# Altium project Hierarchical Example.PrjPcb
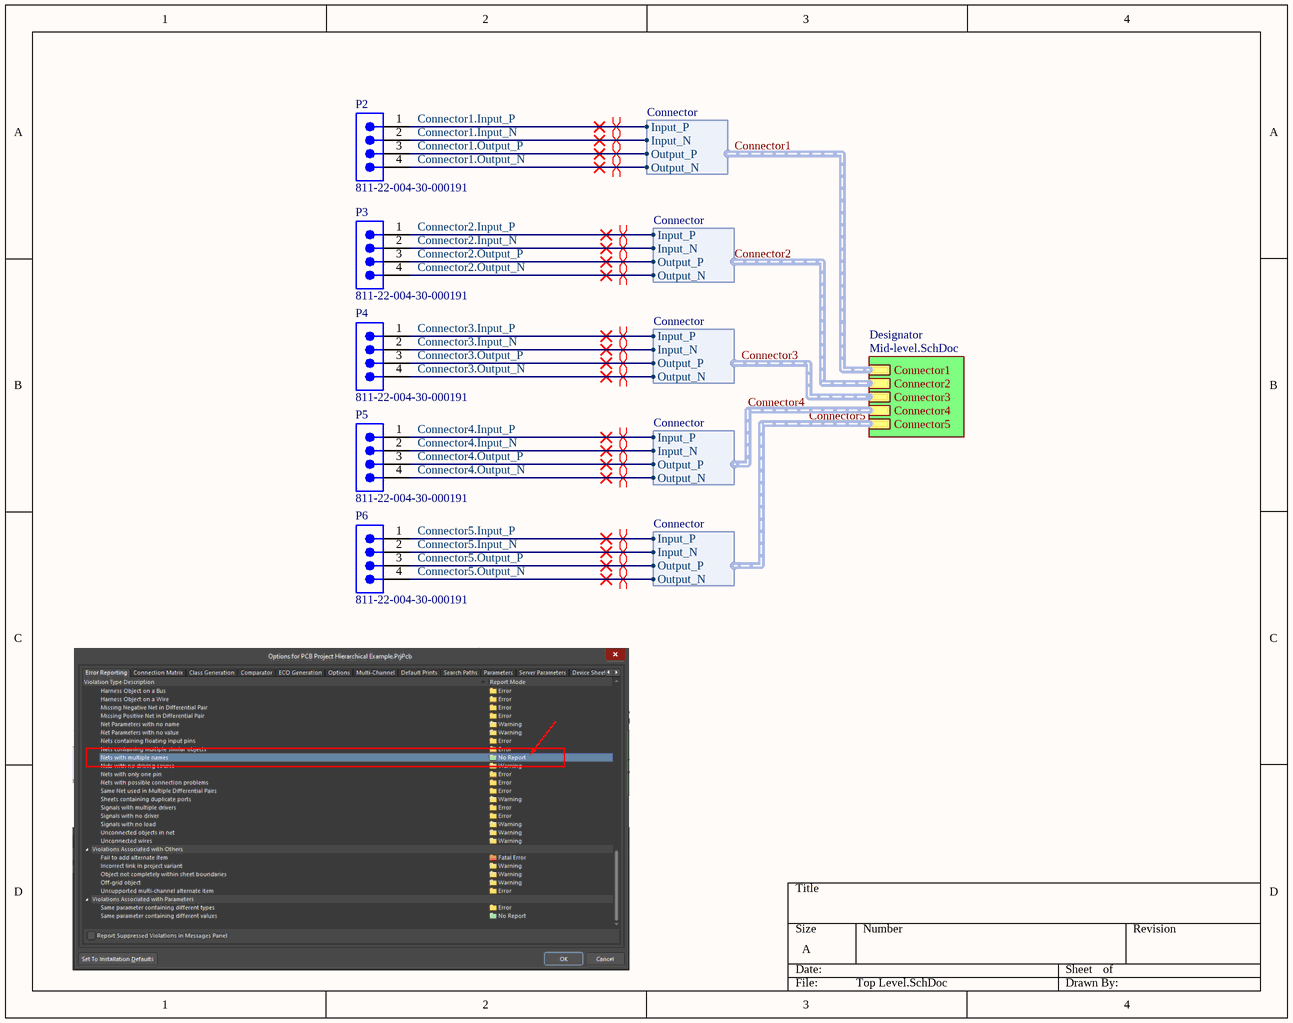
[diagram p0: Top Level.SchDoc]
3 sheets, 10 parts. Net scope: hierarchical (ports join the sheet entries above them; power ports are global).
Board file: Hierarchical Example PCB.PcbDoc
Sheets:
  Top Level.SchDoc
    Designator = Mid-level.SchDoc
      Connector1 = Connector.SchDoc
      Connector2 = Connector.SchDoc
      Connector3 = Connector.SchDoc
      Connector4 = Connector.SchDoc
      Connector5 = Connector.SchDoc

## Sheet Top Level.SchDoc
size A

### Parts
P2  811-22-004-30-000191  [MILL-MAX_811-22-004-30-0001910]
P3  811-22-004-30-000191  [MILL-MAX_811-22-004-30-0001910]
P4  811-22-004-30-000191  [MILL-MAX_811-22-004-30-0001910]
P5  811-22-004-30-000191  [MILL-MAX_811-22-004-30-0001910]
P6  811-22-004-30-000191  [MILL-MAX_811-22-004-30-0001910]

### Sub-sheets
Designator = Mid-level.SchDoc: Connector4 (harness Connector), Connector5 (harness Connector), Connector3 (harness Connector), Connector2 (harness Connector), Connector1 (harness Connector)

### Harnesses
Connector: Input_P, Input_N, Output_P, Output_N

### Nets
Connector1.Input_N: P2.2 ; sheet Designator/Connector1.Input_N  [project net Connector.Input_N]
Connector1.Input_P: P2.1 ; sheet Designator/Connector1.Input_P  [project net Connector.Input_P]
Connector1.Output_N: P2.4 ; sheet Designator/Connector1.Output_N  [project net Connector.Output_N]
Connector1.Output_P: P2.3 ; sheet Designator/Connector1.Output_P  [project net Connector.Output_P]
Connector2.Input_N: P3.2 ; sheet Designator/Connector2.Input_N  [project net Connector.Input_N]
Connector2.Input_P: P3.1 ; sheet Designator/Connector2.Input_P  [project net Connector.Input_P]
Connector2.Output_N: P3.4 ; sheet Designator/Connector2.Output_N  [project net Connector.Output_N]
Connector2.Output_P: P3.3 ; sheet Designator/Connector2.Output_P  [project net Connector.Output_P]
Connector3.Input_N: P4.2 ; sheet Designator/Connector3.Input_N  [project net Connector.Input_N]
Connector3.Input_P: P4.1 ; sheet Designator/Connector3.Input_P  [project net Connector.Input_P]
Connector3.Output_N: P4.4 ; sheet Designator/Connector3.Output_N  [project net Connector.Output_N]
Connector3.Output_P: P4.3 ; sheet Designator/Connector3.Output_P  [project net Connector.Output_P]
Connector4.Input_N: P5.2 ; sheet Designator/Connector4.Input_N  [project net Connector.Input_N]
Connector4.Input_P: P5.1 ; sheet Designator/Connector4.Input_P  [project net Connector.Input_P]
Connector4.Output_N: P5.4 ; sheet Designator/Connector4.Output_N  [project net Connector.Output_N]
Connector4.Output_P: P5.3 ; sheet Designator/Connector4.Output_P  [project net Connector.Output_P]
Connector5.Input_N: P6.2 ; sheet Designator/Connector5.Input_N  [project net Connector.Input_N]
Connector5.Input_P: P6.1 ; sheet Designator/Connector5.Input_P  [project net Connector.Input_P]
Connector5.Output_N: P6.4 ; sheet Designator/Connector5.Output_N  [project net Connector.Output_N]
Connector5.Output_P: P6.3 ; sheet Designator/Connector5.Output_P  [project net Connector.Output_P]

### Buses and harness runs
harness Connector1 = sheet Designator/Connector1
harness Connector2 = sheet Designator/Connector2
harness Connector3 = sheet Designator/Connector3
harness Connector4 = sheet Designator/Connector4
harness Connector5 = sheet Designator/Connector5

### Layout directives
differential pair: Connector.Input_N, Connector.Input_P, Connector.Output_N, Connector.Output_P

### Library data of the parts
P2-P6 = CMP-1650-00001-1: Spring-Loaded Connector, 2.54 Grid Surface Mount, Low Profile Single Row Strip, Vertical, 4-Pin Header, RoHS, Tape and Reel; No. of Positions: 4; Current Rating: 2000 mA; Gender: Male; Pitch: 2.54 mm; No. of Rows: 1; ComponentLink3Description: Package Specification; ComponentLink1Description: Manufacturer URL; Part Number: 811-22-004-30-000191; PartNumber: 811-22-004-30-000191; ComponentLink2URL: http://www.mill-max.com/products/datasheet/sockets/811-22-004-30-000191; ComponentLink2Description: Datasheet; PackageDescription: 4-Pin Header, Body 10.16 x 2.54 mm, Pitch 2.54 mm; Packing: Tape and Reel; ComponentLink1URL: http://www.mill-max.com/; RoHS: TRUE; Orientation: Vertical; ComponentLink3URL: http://www.mill-max.com/assets/pdfs/metric/007M.PDF; Mounting Technology: Surface Mount

## Sheet Mid-level.SchDoc
size A
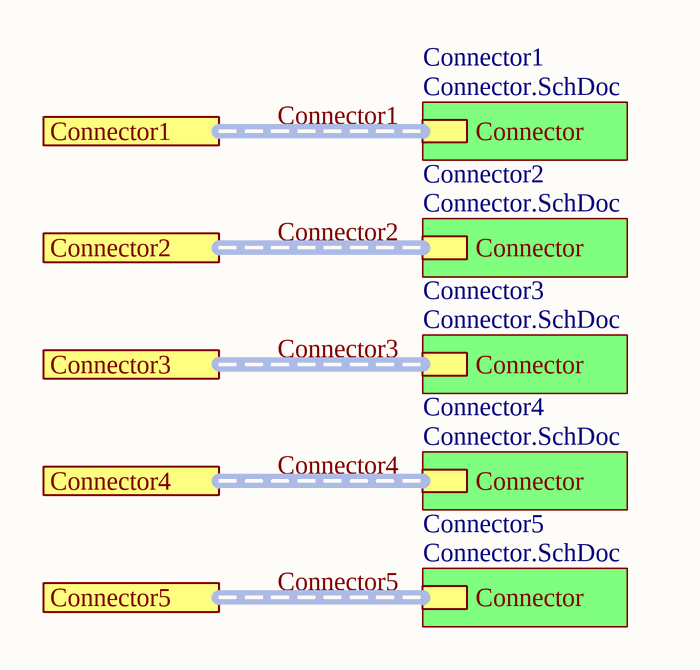
[diagram p1: Mid-level.SchDoc]

### Sub-sheets
Connector1 = Connector.SchDoc: Connector (harness Connector)
Connector2 = Connector.SchDoc: Connector (harness Connector)
Connector3 = Connector.SchDoc: Connector (harness Connector)
Connector4 = Connector.SchDoc: Connector (harness Connector)
Connector5 = Connector.SchDoc: Connector (harness Connector)

### Ports
Connector1 (harness Connector), Connector2 (harness Connector), Connector3 (harness Connector), Connector4 (harness Connector), Connector5 (harness Connector)

### Buses and harness runs
harness Connector1 = port Connector1 = sheet Connector1/Connector
harness Connector2 = port Connector2 = sheet Connector2/Connector
harness Connector3 = port Connector3 = sheet Connector3/Connector
harness Connector4 = port Connector4 = sheet Connector4/Connector
harness Connector5 = port Connector5 = sheet Connector5/Connector

## Sheet Connector.SchDoc
size A
Used 5 times, as channels Designator/Connector1, Designator/Connector2, Designator/Connector3, Designator/Connector4, Designator/Connector5. Parts and nets are listed once, with the designators drawn on the sheet.
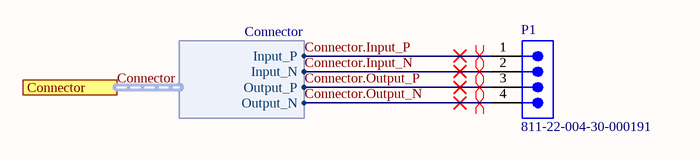
[diagram p2: Connector.SchDoc]

### Parts
P1  811-22-004-30-000191  [MILL-MAX_811-22-004-30-0001910]

### Ports
Connector (harness Connector)

### Harnesses
Connector: Input_P, Input_N, Output_P, Output_N

### Nets
Connector.Input_N: P1.2 ; port Connector.Input_N
Connector.Input_P: P1.1 ; port Connector.Input_P
Connector.Output_N: P1.4 ; port Connector.Output_N
Connector.Output_P: P1.3 ; port Connector.Output_P

### Channels
Designator/Connector1: designators end in _Connector1
Designator/Connector2: designators end in _Connector2
Designator/Connector3: designators end in _Connector3
Designator/Connector4: designators end in _Connector4
Designator/Connector5: designators end in _Connector5

### Buses and harness runs
harness Connector = port Connector

### Layout directives
differential pair: Connector.Input_N, Connector.Input_P, Connector.Output_N, Connector.Output_P

### Library data of the parts
P1 = CMP-1650-00001-1: as P2 on sheet Top Level; ComponentLink3Description: Package Specification; ComponentLink1Description: Manufacturer URL; Part Number: 811-22-004-30-000191; PartNumber: 811-22-004-30-000191; ComponentLink2URL: http://www.mill-max.com/products/datasheet/sockets/811-22-004-30-000191; ComponentLink2Description: Datasheet; PackageDescription: 4-Pin Header, Body 10.16 x 2.54 mm, Pitch 2.54 mm; Packing: Tape and Reel; ComponentLink1URL: http://www.mill-max.com/; RoHS: TRUE; Orientation: Vertical; ComponentLink3URL: http://www.mill-max.com/assets/pdfs/metric/007M.PDF; Mounting Technology: Surface Mount

## Nets that join several sheets
Connector.Input_N: Top Level (P2.2), Designator/Connector1 (P1_Connector1.2)
Connector.Input_N: Top Level (P3.2), Designator/Connector2 (P1_Connector2.2)
Connector.Input_N: Top Level (P4.2), Designator/Connector3 (P1_Connector3.2)
Connector.Input_N: Top Level (P5.2), Designator/Connector4 (P1_Connector4.2)
Connector.Input_N: Top Level (P6.2), Designator/Connector5 (P1_Connector5.2)
Connector.Input_P: Top Level (P2.1), Designator/Connector1 (P1_Connector1.1)
Connector.Input_P: Top Level (P3.1), Designator/Connector2 (P1_Connector2.1)
Connector.Input_P: Top Level (P4.1), Designator/Connector3 (P1_Connector3.1)
Connector.Input_P: Top Level (P5.1), Designator/Connector4 (P1_Connector4.1)
Connector.Input_P: Top Level (P6.1), Designator/Connector5 (P1_Connector5.1)
Connector.Output_N: Top Level (P2.4), Designator/Connector1 (P1_Connector1.4)
Connector.Output_N: Top Level (P3.4), Designator/Connector2 (P1_Connector2.4)
Connector.Output_N: Top Level (P4.4), Designator/Connector3 (P1_Connector3.4)
Connector.Output_N: Top Level (P5.4), Designator/Connector4 (P1_Connector4.4)
Connector.Output_N: Top Level (P6.4), Designator/Connector5 (P1_Connector5.4)
Connector.Output_P: Top Level (P2.3), Designator/Connector1 (P1_Connector1.3)
Connector.Output_P: Top Level (P3.3), Designator/Connector2 (P1_Connector2.3)
Connector.Output_P: Top Level (P4.3), Designator/Connector3 (P1_Connector3.3)
Connector.Output_P: Top Level (P5.3), Designator/Connector4 (P1_Connector4.3)
Connector.Output_P: Top Level (P6.3), Designator/Connector5 (P1_Connector5.3)